# EAGLE schematic ASD2614 (EAGLE 6.3)
DATABASE: ./../../../../../Components/TinyCircuits_Part_Database.txt
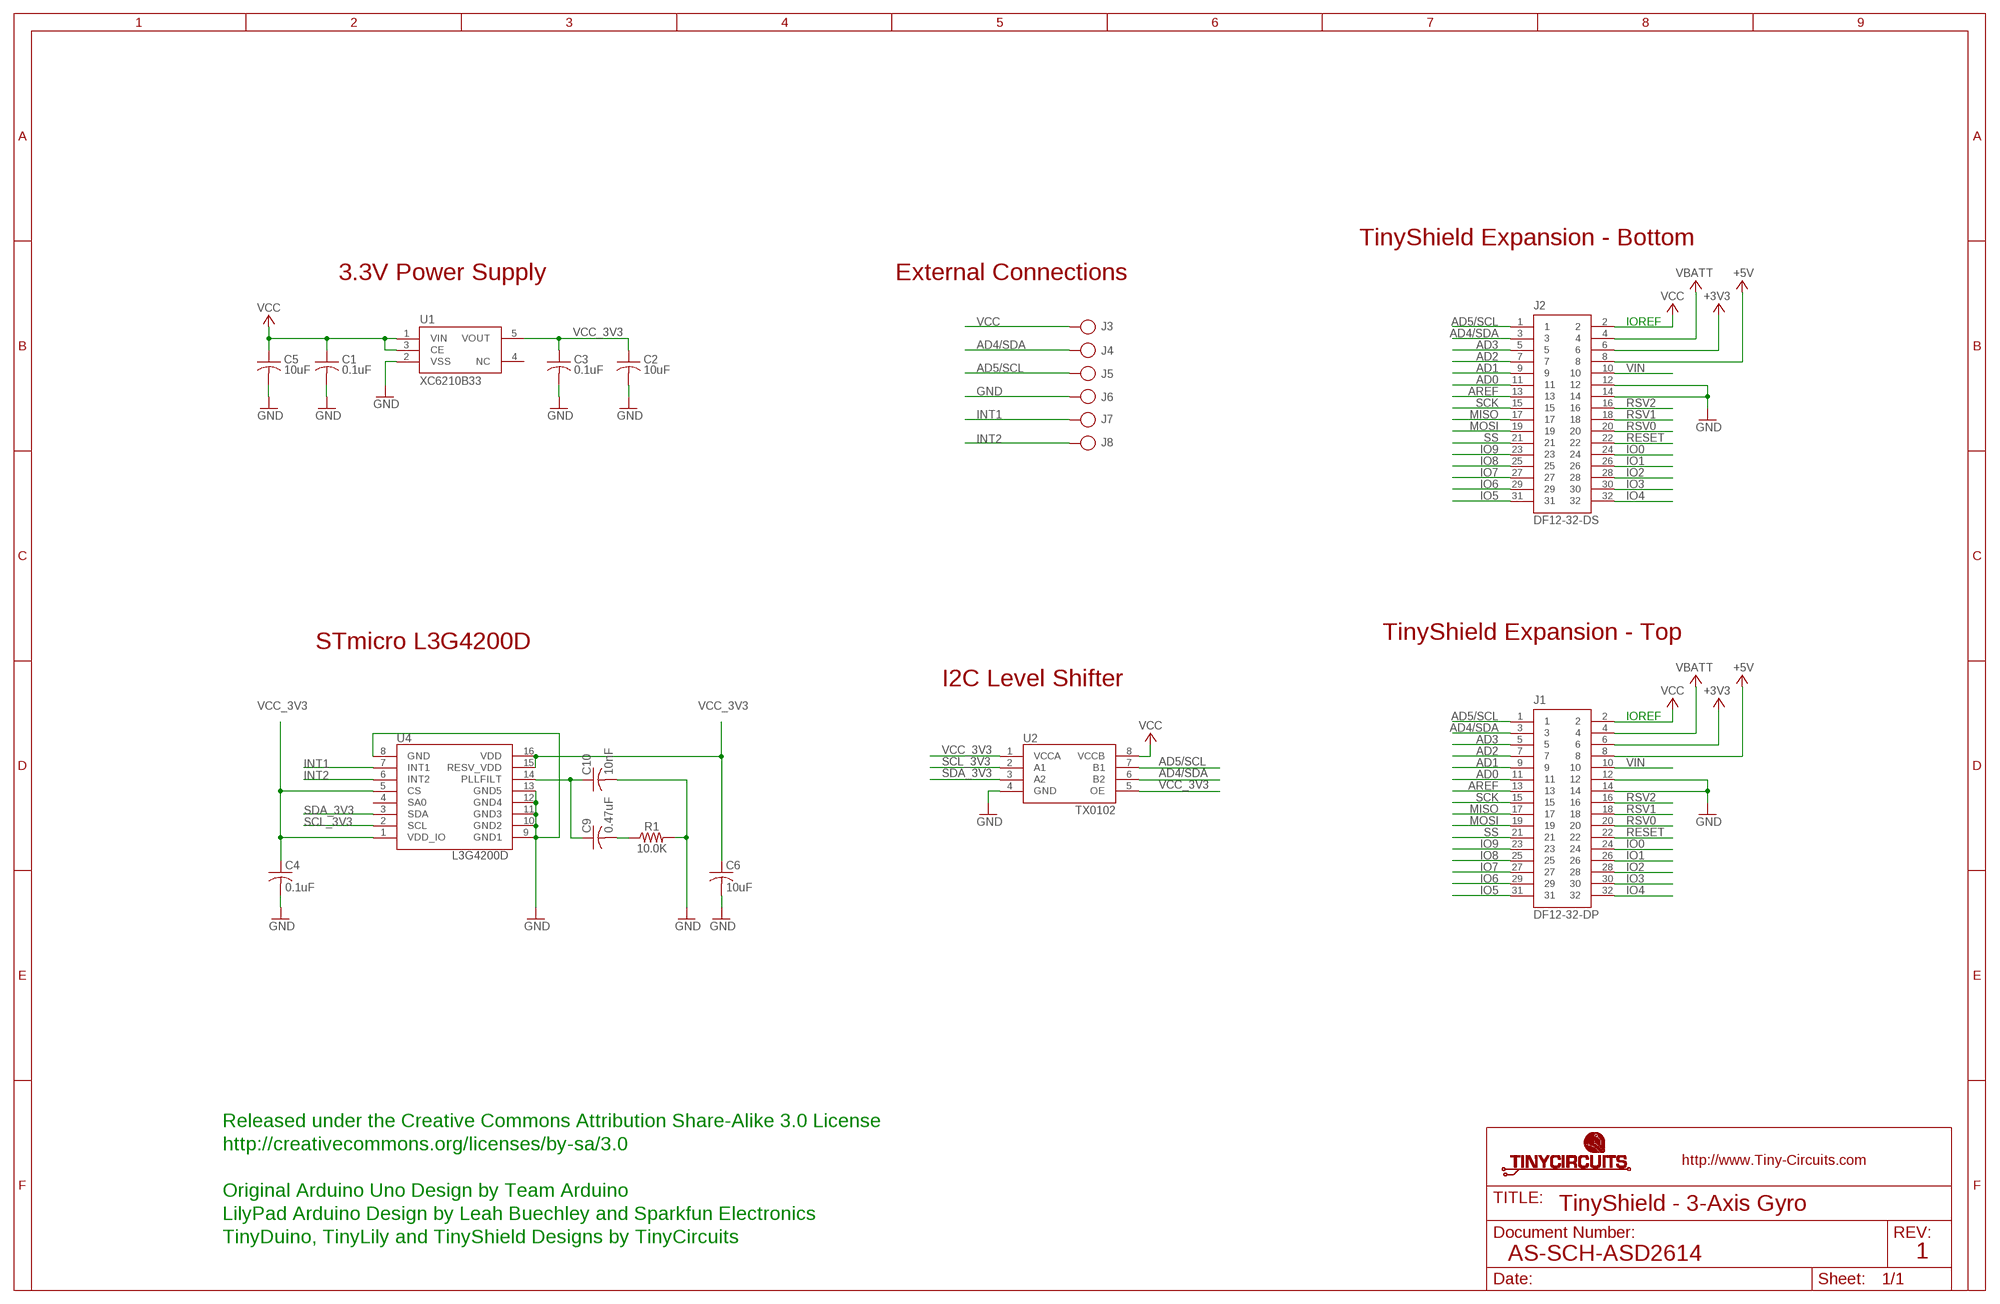
[diagram p0: schematic, sheet 1]

## Parts
C1  0.1uF  AS-ITM-00008  [C0402]
C2  10uF  AS-ITM-00045  [C0805]
C3  0.1uF  AS-ITM-00008  [C0402]
C4  0.1uF  AS-ITM-00008  [C0402]
C5  10uF  AS-ITM-00045  [C0805]
C6  10uF  AS-ITM-00002  [C0603]
C9  0.47uF  AS-ITM-00090  [C0402]
C10  10nF  AS-ITM-00084  [0402]
J1  DF12-32-DP  AS-ITM-00015  [DF12-32-DP]
J2  DF12-32-DS  AS-ITM-00012  [DF12-32-DS]
J3  PIN_1X.1"  [1X.1"]
J4  PIN_1X.1"  [1X.1"]
J5  PIN_1X.1"  [1X.1"]
J6  PIN_1X.1"  [1X.1"]
J7  PIN_1X.1"  [1X.1"]
J8  PIN_1X.1"  [1X.1"]
R1  10.0K  AS-ITM-00032  [0402]
U1  XC6210B33  AS-ITM-00046  [SOT-25]
U2  TX0102  AS-ITM-00073  [DQE(R-PX2SON-N8)]
U4  L3G4200D  AS-ITM-00089  [L3G4200D]

## Nets
+3V3: J1.6 J2.6
+5V: J1.8 J2.8
AD0: J1.11 J2.11
AD1: J1.9 J2.9
AD2: J1.7 J2.7
AD3: J1.5 J2.5
AD4/SDA: J1.3 J2.3 J4.1 U2.6(B2)
AD5/SCL: J1.1 J2.1 J5.1 U2.7(B1)
AREF: J1.13 J2.13
GND: C1.2 C2.2 C3.2 C4.2 C5.2 C6.2 C10.2 J1.12 J1.14 J2.12 J2.14 J6.1 R1.2 U1.2(VSS) U2.4(GND) U4.8(GND) U4.9(GND1) U4.10(GND2) U4.11(GND3) U4.12(GND4) U4.13(GND5)
INT1: J7.1 U4.7(INT1)
INT2: J8.1 U4.6(INT2)
IO0: J1.24 J2.24
IO1: J1.26 J2.26
IO2: J1.28 J2.28
IO3: J1.30 J2.30
IO4: J1.32 J2.32
IO5: J1.31 J2.31
IO6: J1.29 J2.29
IO7: J1.27 J2.27
IO8: J1.25 J2.25
IO9: J1.23 J2.23
MISO: J1.17 J2.17
MOSI: J1.19 J2.19
N$1: C9.2 R1.1
N$2: C9.1 C10.1 U4.14(PLLFILT)
RESET: J1.22 J2.22
RSV0: J1.20 J2.20
RSV1: J1.18 J2.18
RSV2: J1.16 J2.16
SCK: J1.15 J2.15
SCL_3V3: U2.2(A1) U4.2(SCL)
SDA_3V3: U2.3(A2) U4.3(SDA)
SS: J1.21 J2.21
VBATT: J1.4 J2.4
VCC: C1.1 C5.1 J1.2 J2.2 J3.1 U1.1(VIN) U1.3(CE) U2.8(VCCB)
VCC_3V3: C2.1 C3.1 C4.1 C6.1 U1.5(VOUT) U2.1(VCCA) U2.5(OE) U4.1(VDD_IO) U4.5(CS) U4.15(RESV_VDD) U4.16(VDD)
VIN: J1.10 J2.10
Unconnected: U1.4(NC) U4.4(SA0)

## Notes on the sheet
- TinyShield Expansion - Bottom
- 3.3V Power Supply | External Connections
- IOREF
- TinyShield Expansion - Top
- STmicro L3G4200D
- I2C Level Shifter
- IOREF
- Released under the Creative Commons Attribution Share-Alike 3.0 License
- http://creativecommons.org/licenses/by-sa/3.0
- Original Arduino Uno Design by Team Arduino
- TinyShield - 3-Axis Gyro
- LilyPad Arduino Design by Leah Buechley and Sparkfun Electronics
- TinyDuino, TinyLily and TinyShield Designs by TinyCircuits
- AS-SCH-ASD2614 | 1

## Library data of the parts
C1 C3 C4 = tinycircuits:AS-ITM-00008: CAP CER 0.1UF 16V 10% X5R 0402; PARTNO: AS-ITM-00008
C2 C5 = tinycircuits:AS-ITM-00045: CAP CER 16UF 16V 20% X5R 0805; PARTNO: AS-ITM-00045
C6 = tinycircuits:AS-ITM-00002: CAP CER 10UF 10V 20% X5R 0603; PARTNO: AS-ITM-00002
C9 = tinycircuits:AS-ITM-00090: CAP CER 0.47UF 6.3V 20% X5R 0402
C10 = tinycircuits:AS-ITM-00084: CAP CER 10NF25V10% X7R 0402; PARTNO: AS-ITM-00084; VALUE: C1005X7R1E103K050BB
J1 = tinycircuits:AS-ITM-00015: CONN HEADER 32POS 3MM SMD 0.5MM; PARTNO: AS-ITM-00015
J2 = tinycircuits:AS-ITM-00012: CONN RECEPT 32POS 3MM SMD 0.5MM; PARTNO: AS-ITM-00012
J3-J8 = tinycircuits:PIN_1X.1": 1 Pin 0.100" Header
R1 = tinycircuits:AS-ITM-00032: RES 10.0K OHM 1/16W 1% 0402 SMD; PARTNO: AS-ITM-00032
U1 = tinycircuits:AS-ITM-00046: IC REG LDO 3.3V .7A SOT-25; PARTNO: AS-ITM-00046
U2 = tinycircuits:AS-ITM-00073: TI 2-Bit Bidirectional Voltage-Level Translator; PARTNO: AS-ITM-00073; VALUE: TXS0102
U4 = tinycircuits:AS-ITM-00089: Gyroscopes Mems Sensor 3-Axis 2.4 to 3.6 V Gyro; PARTNO: AS-ITM-00089